# EAGLE design ledmatrix (EAGLE 4.16)
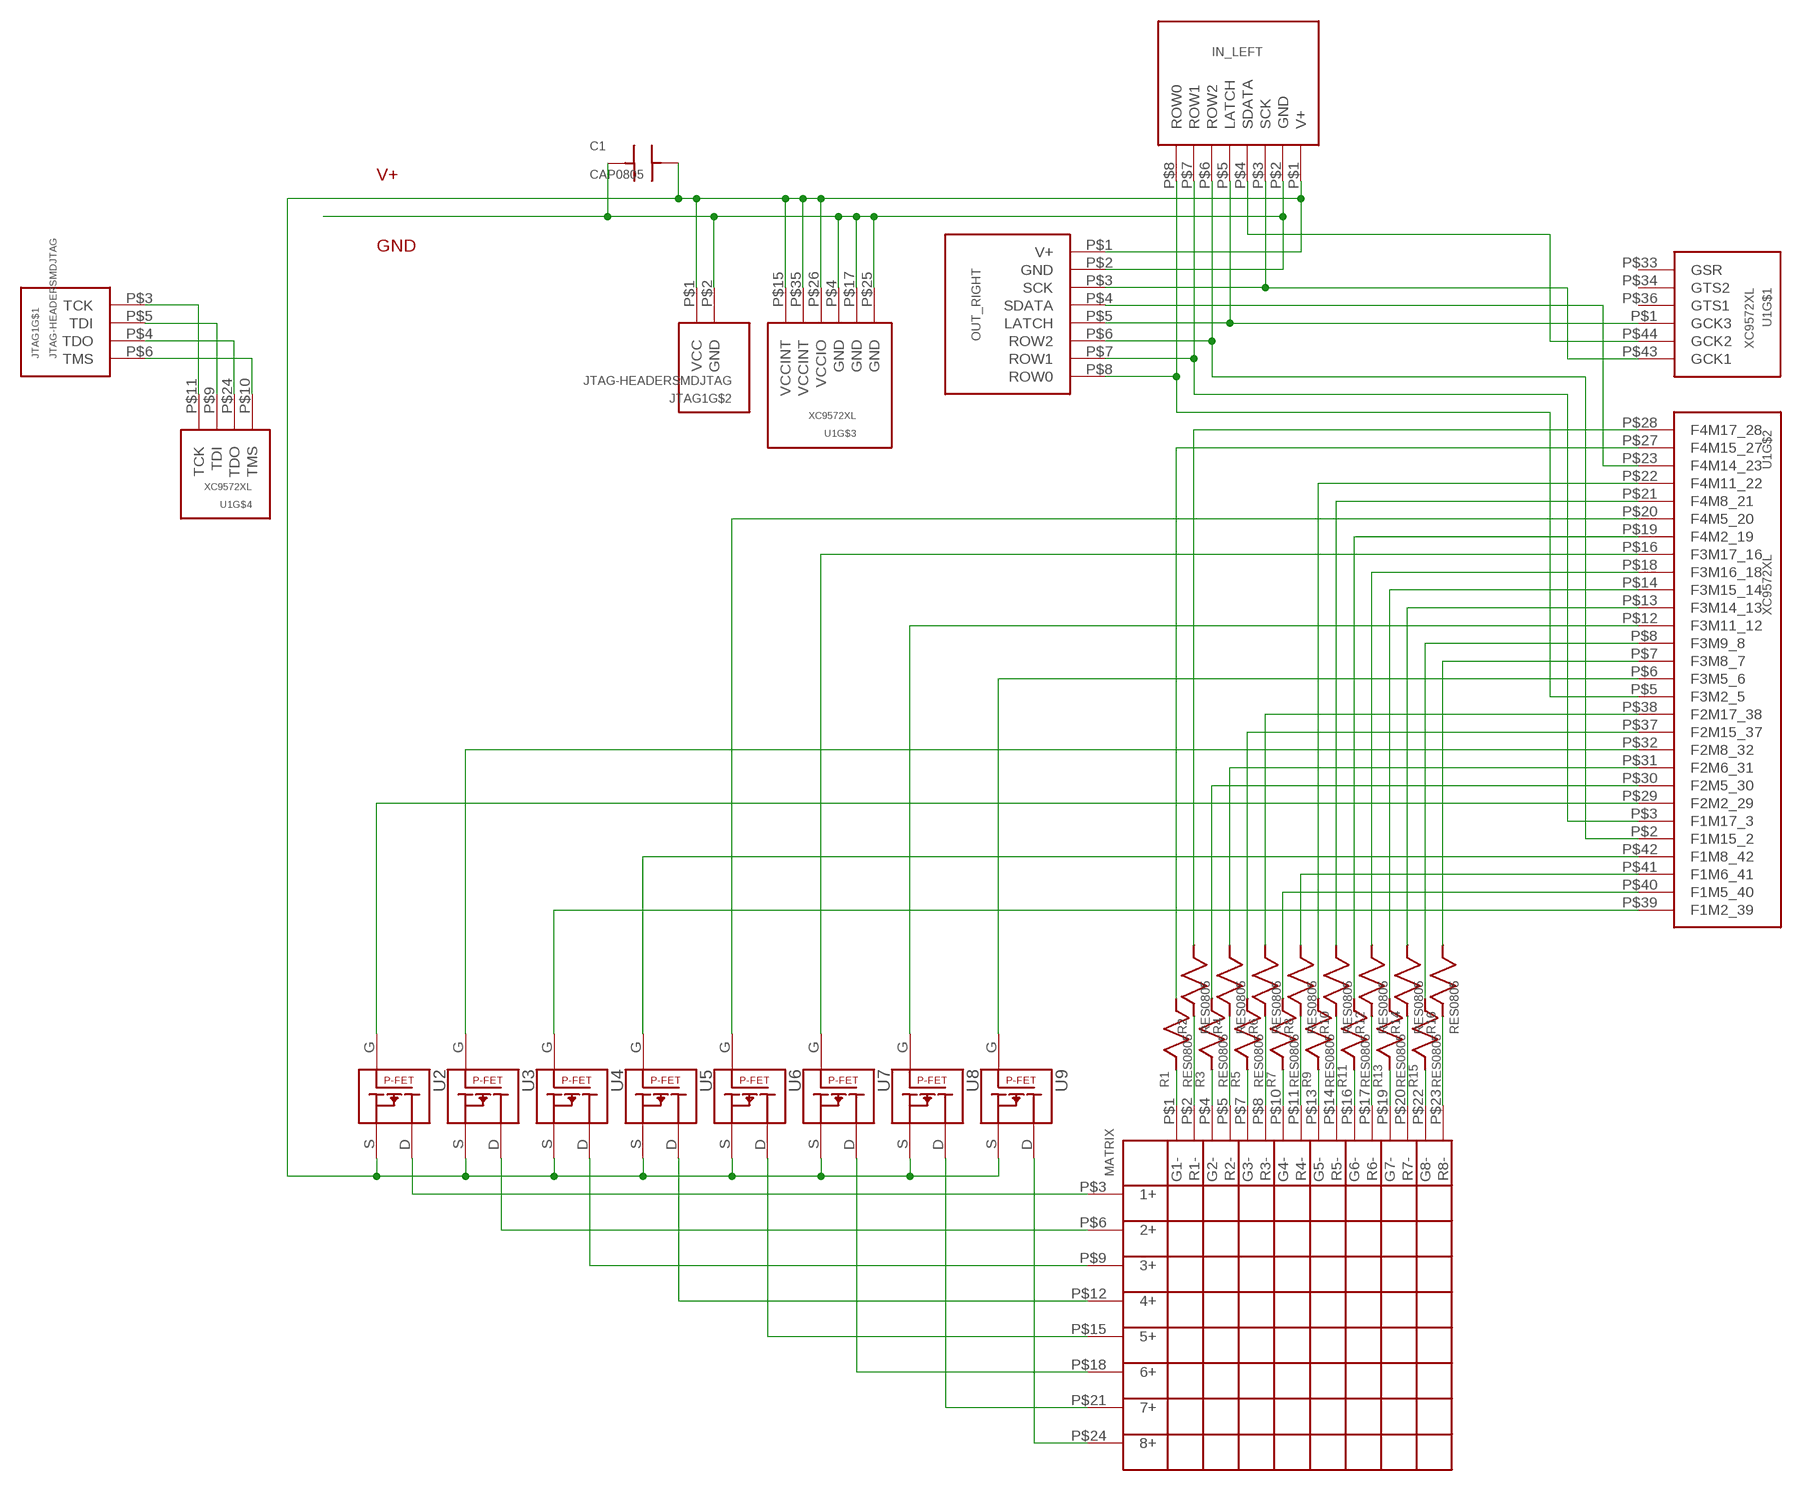
[diagram p0: schematic, sheet 1]

## Parts
C1  CAP0805  [SMD0805]
IN_LEFT  LEDBOARD8_LEFT  [LEDBOARD8_LEFT]
JTAG1  JTAG-HEADERSMDJTAG  [SMDJTAGHEADER6X1]
MATRIX  LEDMATRIX8  [LEDMATRIX_32MM_32MM]
OUT_RIGHT  LEDBOARD8_RIGHT  [LEDBOARD8_RIGHT]
R1  RES0805  [SMD0805]
R2  RES0805  [SMD0805]
R3  RES0805  [SMD0805]
R4  RES0805  [SMD0805]
R5  RES0805  [SMD0805]
R6  RES0805  [SMD0805]
R7  RES0805  [SMD0805]
R8  RES0805  [SMD0805]
R9  RES0805  [SMD0805]
R10  RES0805  [SMD0805]
R11  RES0805  [SMD0805]
R12  RES0805  [SMD0805]
R13  RES0805  [SMD0805]
R14  RES0805  [SMD0805]
R15  RES0805  [SMD0805]
R16  RES0805  [SMD0805]
U1  XC9572XL  [VQ44]
U2  FET_P_SOT23  [SOT-23-FET]
U3  FET_P_SOT23  [SOT-23-FET]
U4  FET_P_SOT23  [SOT-23-FET]
U5  FET_P_SOT23  [SOT-23-FET]
U6  FET_P_SOT23  [SOT-23-FET]
U7  FET_P_SOT23  [SOT-23-FET]
U8  FET_P_SOT23  [SOT-23-FET]
U9  FET_P_SOT23  [SOT-23-FET]

## Nets
N$1: MATRIX.P$24(8+) U9.D(DRAIN)
N$2: MATRIX.P$21(7+) U8.D(DRAIN)
N$3: MATRIX.P$18(6+) U7.D(DRAIN)
N$4: MATRIX.P$15(5+) U6.D(DRAIN)
N$5: MATRIX.P$12(4+) U5.D(DRAIN)
N$6: MATRIX.P$9(3+) U4.D(DRAIN)
N$7: MATRIX.P$6(2+) U3.D(DRAIN)
N$8: MATRIX.P$3(1+) U2.D(DRAIN)
N$9: C1.P$2 IN_LEFT.P$1(V+) JTAG1.P$1(VCC) OUT_RIGHT.P$1(V+) U1.P$15(VCCINT) U1.P$26(VCCIO) U1.P$35(VCCINT) U2.S(SOURCE) U3.S(SOURCE) U4.S(SOURCE) U5.S(SOURCE) U6.S(SOURCE) U7.S(SOURCE) U8.S(SOURCE) U9.S(SOURCE)
N$10: U1.P$6(F3M5_6) U9.G(GATE)
N$11: C1.P$1 IN_LEFT.P$2(GND) JTAG1.P$2(GND) OUT_RIGHT.P$2(GND) U1.P$4(GND) U1.P$17(GND) U1.P$25(GND)
N$12: IN_LEFT.P$3(SCK) OUT_RIGHT.P$3(SCK) U1.P$43(GCK1)
N$13: IN_LEFT.P$5(LATCH) OUT_RIGHT.P$5(LATCH) U1.P$1(GCK3)
N$14: IN_LEFT.P$6(ROW2) OUT_RIGHT.P$6(ROW2) U1.P$2(F1M15_2)
N$15: IN_LEFT.P$7(ROW1) OUT_RIGHT.P$7(ROW1) U1.P$3(F1M17_3)
N$16: IN_LEFT.P$8(ROW0) OUT_RIGHT.P$8(ROW0) U1.P$5(F3M2_5)
N$17: IN_LEFT.P$4(SDATA) U1.P$44(GCK2)
N$18: OUT_RIGHT.P$4(SDATA) U1.P$23(F4M14_23)
N$19: MATRIX.P$1(G1-) R1.P$1
N$20: MATRIX.P$4(G2-) R3.P$1
N$21: MATRIX.P$7(G3-) R5.P$1
N$22: MATRIX.P$10(G4-) R7.P$1
N$23: MATRIX.P$13(G5-) R9.P$1
N$24: MATRIX.P$16(G6-) R11.P$1
N$25: MATRIX.P$19(G7-) R13.P$1
N$26: MATRIX.P$22(G8-) R15.P$1
N$27: MATRIX.P$23(R8-) R16.P$1
N$28: MATRIX.P$20(R7-) R14.P$1
N$29: MATRIX.P$17(R6-) R12.P$1
N$30: MATRIX.P$14(R5-) R10.P$1
N$31: MATRIX.P$11(R4-) R8.P$1
N$32: MATRIX.P$8(R3-) R6.P$1
N$33: MATRIX.P$5(R2-) R4.P$1
N$34: MATRIX.P$2(R1-) R2.P$1
N$35: JTAG1.P$3(TCK) U1.P$11(TCK)
N$36: JTAG1.P$5(TDI) U1.P$9(TDI)
N$37: JTAG1.P$4(TDO) U1.P$24(TDO)
N$38: JTAG1.P$6(TMS) U1.P$10(TMS)
N$39: R16.P$2 U1.P$7(F3M8_7)
N$40: R15.P$2 U1.P$8(F3M9_8)
N$41: U1.P$12(F3M11_12) U8.G(GATE)
N$42: R14.P$2 U1.P$13(F3M14_13)
N$43: R13.P$2 U1.P$14(F3M15_14)
N$44: U1.P$16(F3M17_16) U7.G(GATE)
N$45: R12.P$2 U1.P$18(F3M16_18)
N$46: R11.P$2 U1.P$19(F4M2_19)
N$47: U1.P$20(F4M5_20) U6.G(GATE)
N$48: R10.P$2 U1.P$21(F4M8_21)
N$49: R9.P$2 U1.P$22(F4M11_22)
N$50: R1.P$2 U1.P$27(F4M15_27)
N$51: R2.P$2 U1.P$28(F4M17_28)
N$52: U1.P$29(F2M2_29) U2.G(GATE)
N$53: R3.P$2 U1.P$30(F2M5_30)
N$54: R4.P$2 U1.P$31(F2M6_31)
N$55: U1.P$32(F2M8_32) U3.G(GATE)
N$56: R5.P$2 U1.P$37(F2M15_37)
N$57: R6.P$2 U1.P$38(F2M17_38)
N$58: U1.P$39(F1M2_39) U4.G(GATE)
N$59: R7.P$2 U1.P$40(F1M5_40)
N$60: R8.P$2 U1.P$41(F1M6_41)
N$61: U1.P$42(F1M8_42) U5.G(GATE)
Unconnected: U1.P$33(GSR) U1.P$34(GTS2) U1.P$36(GTS1)

## Notes on the sheet
- V+
- GND

## Library data of the parts
C1 = _sg_misc:CAP0805
IN_LEFT = _sg_misc:LEDBOARD8_LEFT
JTAG1 = _sg_misc:JTAG-HEADER
MATRIX = _sg_misc:LEDMATRIX8
OUT_RIGHT = _sg_misc:LEDBOARD8_RIGHT
R1-R16 = _sg_misc:RES0805
U1 = _sg_misc:XC9572XL
U2-U9 = _sg_misc:FET_P_SOT23

## Board
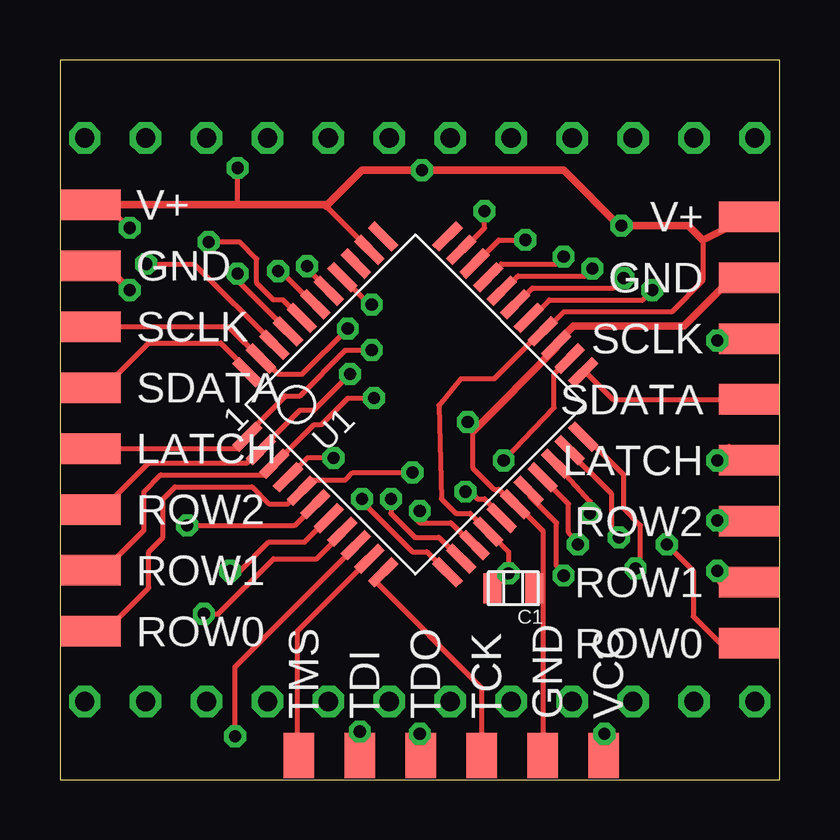
[diagram p1: board, top side]
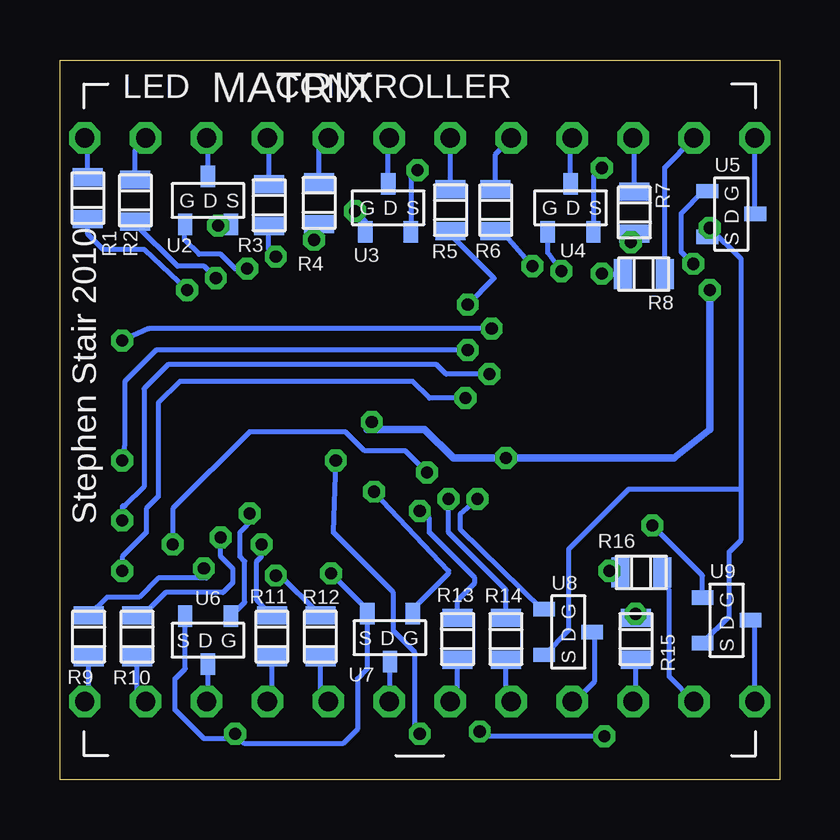
[diagram p2: board, bottom side, seen from below]

Size 30 x 30 mm. Coordinates in mm from the lower left corner, seen from the top.
Outline: 0,0 30,0 30,30 0,30 0,0
Copper layers (1*16): Top 0.035mm / dielectric 1.5mm / Bottom 0.035mm
Design rules "default": minimum track width 8mil, minimum drill 20mil, track to track 8mil, track to pad 8mil, pad to pad 8mil, via to via 8mil, smd to smd 8mil, copper to edge 0mil, drill to drill 8mil, minimum pad ring 10mil, minimum via ring 8mil, stop-mask expansion 4mil, vias tented up to drill 0mil, thermal gap 10mil

### Footprints (pad centres in the part's own frame; a part is rotated, then mirrored left to right if it is on the bottom)
SMD0805 = smd 0.75 x 1.25: P$1 0.125,-0.625; P$2 1.875,-0.625
LEDBOARD8_LEFT = smd 2.54 x 1.27: P$1 1.27,0; P$2 1.27,-2.54; P$3 1.27,-5.08; P$4 1.27,-7.62; P$5 1.27,-10.16; P$6 1.27,-12.7; P$7 1.27,-15.24; P$8 1.27,-17.78
SMDJTAGHEADER6X1 = smd 1.27 x 1.905: P$1 0.635,-0.953; P$2 3.175,-0.953; P$3 5.715,-0.953; P$4 8.255,-0.953; P$5 10.795,-0.953; P$6 13.335,-0.953
LEDMATRIX_32MM_32MM = drill 0.8 octagon: P$1 -13.97,11.748; P$2 -11.43,11.748; P$3 -8.89,11.748; P$4 -6.35,11.748; P$5 -3.81,11.748; P$6 -1.27,11.748; P$7 1.27,11.748; P$8 3.81,11.748; P$9 6.35,11.748; P$10 8.89,11.748; P$11 11.43,11.748; P$12 13.97,11.748; P$13 -13.97,-11.748; P$14 -11.43,-11.748; P$15 -8.89,-11.748; P$16 -6.35,-11.748; P$17 -3.81,-11.748; P$18 -1.27,-11.748; P$19 1.27,-11.748; P$20 3.81,-11.748; P$21 6.35,-11.748; P$22 8.89,-11.748; P$23 11.43,-11.748; P$24 13.97,-11.748
LEDBOARD8_RIGHT = smd 2.54 x 1.27: P$1 -1.27,-0.635; P$2 -1.27,-3.175; P$3 -1.27,-5.715; P$4 -1.27,-8.255; P$5 -1.27,-10.795; P$6 -1.27,-13.335; P$7 -1.27,-15.875; P$8 -1.27,-18.415
VQ44 = smd 1.4 x 0.4: P$1 -0.9,-1; P$2 -0.9,-1.8; P$3 -0.9,-2.6; P$4 -0.9,-3.4; P$5 -0.9,-4.2; P$6 -0.9,-5; P$7 -0.9,-5.8; P$8 -0.9,-6.6; P$9 -0.9,-7.4; P$10 -0.9,-8.2; P$11 -0.9,-9; P$23 10.9,-9; P$24 10.9,-8.2; P$25 10.9,-7.4; P$26 10.9,-6.6; P$27 10.9,-5.8; P$28 10.9,-5; P$29 10.9,-4.2; P$30 10.9,-3.4; P$31 10.9,-2.6; P$32 10.9,-1.8; P$33 10.9,-1 | smd 0.4 x 1.4: P$12 1,-10.9; P$13 1.8,-10.9; P$14 2.6,-10.9; P$15 3.4,-10.9; P$16 4.2,-10.9; P$17 5,-10.9; P$18 5.8,-10.9; P$19 6.6,-10.9; P$20 7.4,-10.9; P$21 8.2,-10.9; P$22 9,-10.9; P$34 9,0.9; P$35 8.2,0.9; P$36 7.4,0.9; P$37 6.6,0.9; P$38 5.8,0.9; P$39 5,0.9; P$40 4.2,0.9; P$41 3.4,0.9; P$42 2.6,0.9; P$43 1.8,0.9; P$44 1,0.9
SOT-23-FET = smd 0.6 x 0.9: D 0,1; G -0.95,-1; S 0.95,-1

### Placement (x,y rotation side)
C1  19.9,7.35 180 top
IN_LEFT  0,23.96 0 top
JTAG1  23.3,0.05 180 top
MATRIX  15,15 0 bottom
OUT_RIGHT  30,24.1 0 top
R1  28.21,25.24 270 bottom
R2  26.23,25.14 270 bottom
R3  20.65,24.94 270 bottom
R4  18.57,25.04 270 bottom
R5  13.09,24.74 270 bottom
R6  11.21,24.74 270 bottom
R7  5.43,24.64 270 bottom
R8  4.66,20.45 180 bottom
R9  29.43,4.96 90 bottom
R10  27.41,4.96 90 bottom
R11  21.79,4.96 90 bottom
R12  19.77,4.96 90 bottom
R13  14.05,4.86 90 bottom
R14  12.03,4.86 90 bottom
R15  6.61,4.86 90 bottom
R16  4.76,8.01 180 bottom
U1  7.74,15.64 45 top
U2  23.83,24.14 0 bottom
U3  16.32,23.84 0 bottom
U4  8.71,23.84 0 bottom
U5  2.01,23.58 270 bottom
U6  23.83,5.81 180 bottom
U7  16.24,5.91 180 bottom
U8  8.81,6.15 270 bottom
U9  2.21,6.64 270 bottom

### Tracks (layer width: path | path; a pad name or v marks a point on that pad's centre or on a via)
N$1
  Bottom 0.203: U9.D 1.21,6.61 1.03,6.43 MATRIX.P$24
N$2
  Bottom 0.203: MATRIX.P$21 | MATRIX.P$21 8.7,3.2 | MATRIX.P$21 8.55,3.25 7.7,4.1 7.7,6.1 7.75,6.15 U8.D
N$3
  Bottom 0.203: 16.24,3.24 16.25,3.25 MATRIX.P$18 | 16.24,3.24 U7.D | 16.24,3.24 16.2,3.2
N$4
  Bottom 0.203: 23.89,3.21 23.9,3.2 | MATRIX.P$15 23.89,3.21 | U6.D 23.83,3.27 23.89,3.21
N$5
  Bottom 0.203: U5.D 0.92,23.58 0.9,23.6 1.03,23.73 MATRIX.P$12
N$6
  Bottom 0.203: MATRIX.P$9 8.7,26.8 8.71,26.79 U4.D
N$7
  Bottom 0.203: MATRIX.P$6 16.27,26.73 16.32,26.68 U3.D
N$8
  Bottom 0.203: MATRIX.P$3 23.95,26.75 24,26.7 23.83,26.53 U2.D
N$9  (via drill 0.51)
  Top 0.203: 26.8,22.5 26.8,20.8 25.5,19.5 21,19.5 20.12,18.62 | 12.92,22.08 13.1,21.9 | 12.92,22.08 U1.P$35 | 11.04,23.96 11.1,23.9 12.92,22.08 | IN_LEFT.P$1 1.94,23.96 v2.9,23 | 7.4,23.96 v7.4,25.5 | 14.6,25.4 v15.1,25.4 | 23.4,23 v23.4,23.1 | JTAG1.P$1 22.66,0.83 22.7,0.8 v22.7,1.9 | U1.P$26 20.18,18.68 | 20.12,18.62 20.1,18.6 | 20.12,18.62 U1.P$26 | U1.P$26 20.1,18.7 18.1,16.7 16.7,16.7 15.8,15.6 15.9,11.7 16.5,11.1 17.1,11.1 U1.P$15 17.86,10.34 18.7,9.5 v18.7,8.6 18.07,7.97 C1.P$2 | U1.P$26
  Top 0.305: OUT_RIGHT.P$1 26.8,22.5 26.2,23.1 v23.4,23.1 | IN_LEFT.P$1 7.4,23.96 11.04,23.96 | 11.1,23.9 12.6,25.4 14.6,25.4 21,25.4 23.4,23
  Bottom 0.203: U5.S 3.01,22.61 3,22.6 2.9,22.7 v2.9,23 | U2.S 23.36,23.14 v23.4,23.1 | U4.S 7.76,25.14 v7.4,25.5 | U3.S 15.37,25.13 v15.1,25.4 | U6.S 24.78,4.62 25.2,4.2 25.2,2.9 24,1.7 23,1.7 22.8,1.9 v22.7,1.9 22.3,1.5 18.2,1.5 17.6,2.1 17.6,4.2 17.19,4.61 U7.S 17.19,7.09 v18.7,8.6 | U9.S 2.1,6.8 2.1,9.5 1.6,10 1.6,12.1 | 1.6,12.1 1.6,21.7 v2.9,23 | v2.9,23 3.1,23 | U8.S 8.8,6.21 8.8,9.6 6.3,12.1 1.6,12.1
N$10  (via drill 0.51)
  Top 0.203: 10.67,11.47 10.7,11.5 | 10.67,11.47 U1.P$6 | v5.3,10.6 9.8,10.6 10.67,11.47
  Bottom 0.203: U9.G 3.21,8.51 v5.3,10.6
N$11  (via drill 0.51)
  Top 0.203: 28.02,20.93 OUT_RIGHT.P$2 | 1.88,21.42 IN_LEFT.P$2 | U1.P$4 | U1.P$4 | v11.4,13.4 10.3,13.4 U1.P$4 | 18.98,11.52 18.9,11.6 | 18.98,11.52 U1.P$17 18.98,11.48 19,11.5 | 20.12,8 20.12,10.38 19,11.5 | 20.12,8 JTAG1.P$2 | 19,11.5 18.98,11.52 | 20,17.4 20.6,18 20.6,18.1 20.62,18.12 U1.P$25 20.68,17.98 | 19,11.5 18.9,11.5 18.3,12.1 18.1,12.1 17.2,13 17.2,14.5 17.25,14.55 17.2,14.6 17.2,14.7 v17,14.9 | 20.12,8 20.1,8 20.07,7.97 C1.P$1
  Top 0.305: 28.02,20.93 26,18.9 21.4,18.9 20.62,18.12 | v2.9,20.4 1.88,21.42 | 17.25,14.55 20.68,17.98
  Bottom 0.203: 17.2,14.6 v17,14.9
  Bottom 0.305: v2.9,20.4 2.9,14.6 4.4,13.4 v11.4,13.4 13.6,13.4 14.8,14.6 17.2,14.6
N$12  (via drill 0.51)
  Top 0.203: 8.38,17.52 8.4,17.5 8.5,17.5 9.1,16.9 10.1,16.9 v12,18.8 | 8.38,17.52 U1.P$43 | IN_LEFT.P$3 7.02,18.88 8.38,17.52 | OUT_RIGHT.P$3 28.61,18.39 28.6,18.4 28.2,18 v27.4,18.3
  Bottom 0.203: v12,18.8 26.3,18.8 v27.4,18.3
N$13  (via drill 0.51)
  Top 0.203: 7.9,14.3 8,14.4 8,14.6 9.4,16 10,16 11.9,17.9 v13,17.9 | 7.9,14.3 U1.P$1 | IN_LEFT.P$5 7.4,13.8 7.9,14.3 | OUT_RIGHT.P$5 28.7,13.3 28.6,13.2 27.9,13.9 v27.4,13.3
  Bottom 0.203: v13,17.9 26,17.9 27.3,16.6 27.3,14 v27.4,13.3
N$14  (via drill 0.51)
  Top 0.203: IN_LEFT.P$6 1.76,11.26 3.7,13.2 7.8,13.2 8.38,13.78 | 8.38,13.78 U1.P$2 | 8.38,13.78 10,15.4 10.6,15.4 v12.1,16.9 | 28.77,10.8 28.9,10.8 | 28.77,10.8 OUT_RIGHT.P$6 | v27.4,10.8 28.77,10.8
  Bottom 0.203: v12.1,16.9 13.9,16.9 14.3,17.3 25.5,17.3 26.5,16.3 26.5,12.2 27.3,11.4 27.4,11.4 v27.4,10.8
N$15  (via drill 0.51)
  Top 0.203: IN_LEFT.P$7 1.82,8.72 3.5,10.4 3.5,12 4.2,12.7 8.5,12.7 8.97,13.17 | 8.97,13.17 U1.P$3 | 8.97,13.17 10.6,14.8 10.9,14.8 12,15.9 v13.1,15.9 | 28.75,8.2 28.9,8.2 | 28.75,8.2 OUT_RIGHT.P$7 | v27.4,8.7 27.5,8.2 28.75,8.2
  Bottom 0.203: v13.1,15.9 14.6,15.9 15.3,16.6 25,16.6 25.9,15.7 25.9,11.8 26.4,11.3 26.4,10.3 27.4,9.3 v27.4,8.7
N$16  (via drill 0.51)
  Top 0.203: IN_LEFT.P$8 1.88,6.18 3.7,8 3.7,9.5 4.3,10.1 4.3,11.7 4.8,12.2 8,12.2 8.7,11.5 9.5,11.5 10.08,12.08 | 10.08,12.08 U1.P$5 | 10.08,12.08 10.5,12.5 11.9,12.5 12.2,12.8 v14.7,12.8 | v25.3,9.8 26.4,8.7 26.4,6.8 27.5,5.7 28.75,5.7 | 28.75,5.7 28.8,5.7 | 28.75,5.7 OUT_RIGHT.P$8
  Bottom 0.203: v14.7,12.8 15.6,13.7 17.3,13.7 18.1,14.5 22.1,14.5 25.3,11.3 v25.3,9.8
N$17
  Top 0.203: IN_LEFT.P$4 1.84,16.34 3.7,18.2 6.7,18.2 7.91,16.99 | 7.91,16.99 8,16.9 | 7.91,16.99 U1.P$44
N$18
  Top 0.203: U1.P$23 21.89,16.99 21.9,17 23.05,15.85 OUT_RIGHT.P$4
N$19
  Bottom 0.203: MATRIX.P$1 28.97,26.73 29,26.7 28.84,26.54 R1.P$1
N$20
  Bottom 0.203: MATRIX.P$4 21.4,26.7 21.27,26.57 R3.P$1
N$21
  Bottom 0.203: MATRIX.P$7 13.75,26.75 13.8,26.7 13.71,26.61 R5.P$1
N$22
  Bottom 0.203: MATRIX.P$10 6.11,26.69 6.2,26.6 6.05,26.45 R7.P$1
N$23
  Bottom 0.203: MATRIX.P$13 28.97,3.27 29,3.3 28.8,3.5 R9.P$1
N$24
  Bottom 0.203: MATRIX.P$16 21.35,3.35 21.4,3.4 21.16,3.63 R11.P$1
N$25
  Bottom 0.203: MATRIX.P$19 13.73,3.27 13.43,3.58 R13.P$1
N$26
  Bottom 0.203: MATRIX.P$22 6.11,3.29 5.99,3.42 R15.P$1
N$27
  Bottom 0.203: R16.P$1 4.88,8.19 4.6,7.9 4.6,4.3 3.57,3.27 MATRIX.P$23
N$28
  Bottom 0.203: MATRIX.P$20 11.19,3.29 11.4,3.5 R14.P$1
N$29
  Bottom 0.203: MATRIX.P$17 18.81,3.39 18.8,3.4 19.14,3.75 R12.P$1
N$30
  Bottom 0.203: MATRIX.P$14 26.43,3.27 26.4,3.3 26.79,3.69 R10.P$1
N$31
  Bottom 0.203: MATRIX.P$11 3.57,26.73 4.79,25.52 R8.P$1
N$32
  Bottom 0.203: MATRIX.P$8 11.19,26.71 11.84,26.07 R6.P$1
N$33
  Bottom 0.203: MATRIX.P$5 18.81,26.71 18.8,26.7 19.2,26.3 R4.P$1
N$34
  Bottom 0.203: MATRIX.P$2 26.43,26.67 26.86,26.25 R2.P$1
N$35
  Top 0.203: U1.P$11 13.17,8.23 17.6,3.8 17.6,0.9 17.59,0.89 | 17.59,0.89 17.5,0.8 | JTAG1.P$3 17.59,0.89
N$36  (via drill 0.51)
  Top 0.203: U1.P$9 12.34,9.74 7.3,4.7 v7.3,1.8 | JTAG1.P$5 12.51,0.91 12.5,0.9 v12.5,2
  Bottom 0.203: v7.3,1.8 12.3,1.8 v12.5,2
N$37  (via drill 0.51)
  Top 0.203: U1.P$24 20.6,16.9 20.6,15.5 v18.5,13.3 | JTAG1.P$4 15.04,0.94 15,0.9 v15,1.9
  Bottom 0.203: v18.5,13.3 18.6,10.3 16.1,7.8 16.1,6.2 15.2,5.3 15.2,2.1 v15,1.9
N$38
  Top 0.203: U1.P$10 9.9,6.2 9.9,0.9 9.96,0.83 | 9.96,0.83 10,0.8 | JTAG1.P$6 9.96,0.83
N$39  (via drill 0.51)
  Top 0.203: v7.1,8.7 7.5,8.7 8.7,9.9 10.2,9.9 U1.P$7
  Bottom 0.203: R16.P$2 7.04,8.63 v7.1,8.7
N$40  (via drill 0.51)
  Top 0.203: v6,6.9 6.6,6.9 8.9,9.2 10.7,9.2 11.8,10.3 11.77,10.33 U1.P$8
  Bottom 0.203: R15.P$2 5.99,6.88 v6,6.9
N$41  (via drill 0.51)
  Top 0.203: 16.3,8.6 16.26,8.64 U1.P$12 | v12.6,11.7 12.6,11.6 14.7,9.5 15.3,9.5 U1.P$12 | U1.P$12 16.2,8.6
  Bottom 0.203: U8.G 9.9,7.1 13.3,10.4 13.3,11.1 v12.6,11.7
N$42  (via drill 0.51)
  Top 0.203: v13.8,11.7 13.8,11.1 14.8,10.1 15.8,10.1 16.72,9.18 | 16.72,9.18 16.8,9.1 | 16.72,9.18 U1.P$13
  Bottom 0.203: R14.P$2 11.4,7.91 13.8,10.3 v13.8,11.7
N$43  (via drill 0.51)
  Top 0.203: v15,11.2 14.9,10.8 15,10.7 16.3,10.7 17.23,9.77 | 17.23,9.77 17.4,9.7 | 17.23,9.77 U1.P$14
  Bottom 0.203: R13.P$2 13.43,7.47 12.7,8.2 12.7,8.4 14.6,10.3 14.6,10.9 14.8,11.1 14.8,11.2 v15,11.2
N$44  (via drill 0.51)
  Top 0.203: 18.5,10.9 | 18.5,10.9 U1.P$16 | v16.9,12 16.9,12.2 17.4,11.7 17.7,11.7 18.5,10.9
  Bottom 0.203: U7.G 15.29,7.11 13.8,8.6 13.8,8.7 v16.9,12
N$45  (via drill 0.51)
  Top 0.203: v21,8.5 20.7,8.9 20.7,10.7 19.6,11.8 19.6,12 19.59,12 U1.P$18
  Bottom 0.203: R12.P$2 20.91,8.6 v21,8.5
N$46  (via drill 0.51)
  Top 0.203: v21.6,9.8 21.2,10.3 21.2,11.5 20.2,12.5 20.1,12.5 20.1,12.59 U1.P$19
  Bottom 0.203: R11.P$2 21.8,7.47 21.8,9.1 21.6,9.3 v21.6,9.8
N$47  (via drill 0.51)
  Top 0.203: v22.1,11.1 22.1,11.6 20.9,12.9 20.7,13.1 20.7,13.15 U1.P$20
  Bottom 0.203: U6.G 22.3,7.39 22.3,9.1 22.5,9.3 22.5,10.3 21.9,10.9 v22.1,11.1
N$48  (via drill 0.51)
  Top 0.203: v23.3,10.1 23,10.4 23,11.9 21.1,13.8 21.18,13.8 U1.P$21
  Bottom 0.203: R10.P$2 26.62,7 26.4,7 25.6,7.8 23.2,7.8 22.8,8.2 22.8,8.8 23.3,9.3 v23.3,10.1
N$49  (via drill 0.51)
  Top 0.203: v24,8.8 24.2,9 24.2,10.6 23.5,11.3 23.5,12.7 21.9,14.3 U1.P$22
  Bottom 0.203: R9.P$2 28.04,7.6 26.7,7.6 25.9,8.4 23.9,8.4 24,8.5 v24,8.8
N$50  (via drill 0.51)
  Top 0.203: 19.55,19.15 19.5,19.1 | U1.P$27 19.55,19.15 | 19.55,19.15 20.4,20 24.3,20 v24.7,20.4
  Bottom 0.203: R1.P$2 28.84,22.73 28.2,22.1 26.5,22.1 v24.7,20.4
N$51  (via drill 0.51)
  Top 0.203: 18.98,19.89 U1.P$28 19.7,20.5 23.1,20.5 v23.5,20.9
  Bottom 0.203: R2.P$2 26.86,23.16 25.1,21.4 24,21.4 v23.5,20.9
N$52  (via drill 0.51)
  Top 0.203: U1.P$29 18.48,20.38 19.1,21 21.9,21 v22.2,21.3
  Bottom 0.203: v22.2,21.3 22.7,21.3 23.3,21.9 24.2,21.9 24.8,22.5 24.8,23.1 24.78,23.12 U2.G
N$53  (via drill 0.51)
  Top 0.203: U1.P$30 18.4,21.5 20.7,21.5 v21,21.8
  Bottom 0.203: v21,21.8 21.3,22.1 21.3,23 21.27,23.02 R3.P$2
N$54  (via drill 0.51)
  Top 0.203: U1.P$31 18.3,22.5 v19.4,22.5
  Bottom 0.203: R4.P$2 19.2,22.7 v19.4,22.5
N$55  (via drill 0.51)
  Top 0.203: U1.P$32 16.78,22.08 17.7,23 v17.7,23.7
  Bottom 0.203: U3.G 17.27,23.27 v17.7,23.7
N$56  (via drill 0.51)
  Top 0.203: U1.P$37 11.77,20.93 12.9,19.8 v13,19.8
  Bottom 0.203: R5.P$2 13.71,22.71 11.9,20.9 v13,19.8
N$57  (via drill 0.51)
  Top 0.203: 11.3,20.3 U1.P$38 | U1.P$38 | v10.3,21.4 10.3,21.3 U1.P$38
  Bottom 0.203: R6.P$2 11.56,22.86 v10.3,21.4
N$58  (via drill 0.51)
  Top 0.203: U1.P$39 10.61,19.81 10.6,19.8 9.2,21.2 v9.1,21.2
  Bottom 0.203: U4.G 9.66,21.96 v9.1,21.2
N$59  (via drill 0.51)
  Top 0.203: v6.2,22.4 7.5,22.4 8.2,21.7 8.2,20.7 8.9,20 9.3,20 10.08,19.22 | 10.08,19.22 10.2,19.1 | U1.P$40 10.08,19.22
  Bottom 0.203: R7.P$2 6.05,22.64 6.2,22.5 v6.2,22.4
N$60  (via drill 0.51)
  Top 0.203: U1.P$41 7.4,20.8 v7.4,21.1
  Bottom 0.203: R8.P$2 7.38,21.07 v7.4,21.1
N$61  (via drill 0.51)
  Top 0.203: 8.98,18.12 9.1,18 | 8.98,18.12 U1.P$42 | v3.6,21.5 5.6,21.5 8.98,18.12
  Bottom 0.203: U5.G 3.17,24.53 4.1,23.6 4.1,22 v3.6,21.5

### Text on the board
bPlace: LED CONTROLLER | Stephen Stair 2010